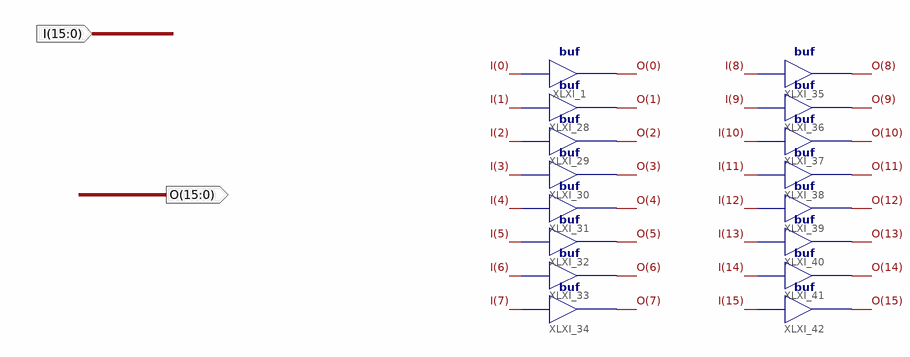
[diagram p0: schematic sheet 1]
// Xilinx ISE schematic buf16.sch (spartan3adsp) as structural Verilog: 16 symbols, 2 ports
module buf16 (
  input  [15:0] I,
  output [15:0] O
);

  buf XLXI_34 (O[7], I[7]);
  buf XLXI_33 (O[6], I[6]);
  buf XLXI_32 (O[5], I[5]);
  buf XLXI_31 (O[4], I[4]);
  buf XLXI_30 (O[3], I[3]);
  buf XLXI_29 (O[2], I[2]);
  buf XLXI_28 (O[1], I[1]);
  buf XLXI_1 (O[0], I[0]);
  buf XLXI_35 (O[8], I[8]);
  buf XLXI_36 (O[9], I[9]);
  buf XLXI_37 (O[10], I[10]);
  buf XLXI_38 (O[11], I[11]);
  buf XLXI_39 (O[12], I[12]);
  buf XLXI_40 (O[13], I[13]);
  buf XLXI_41 (O[14], I[14]);
  buf XLXI_42 (O[15], I[15]);
endmodule
